# EAGLE design patch (EAGLE 7.2.0)

## Sheet 1 of 3
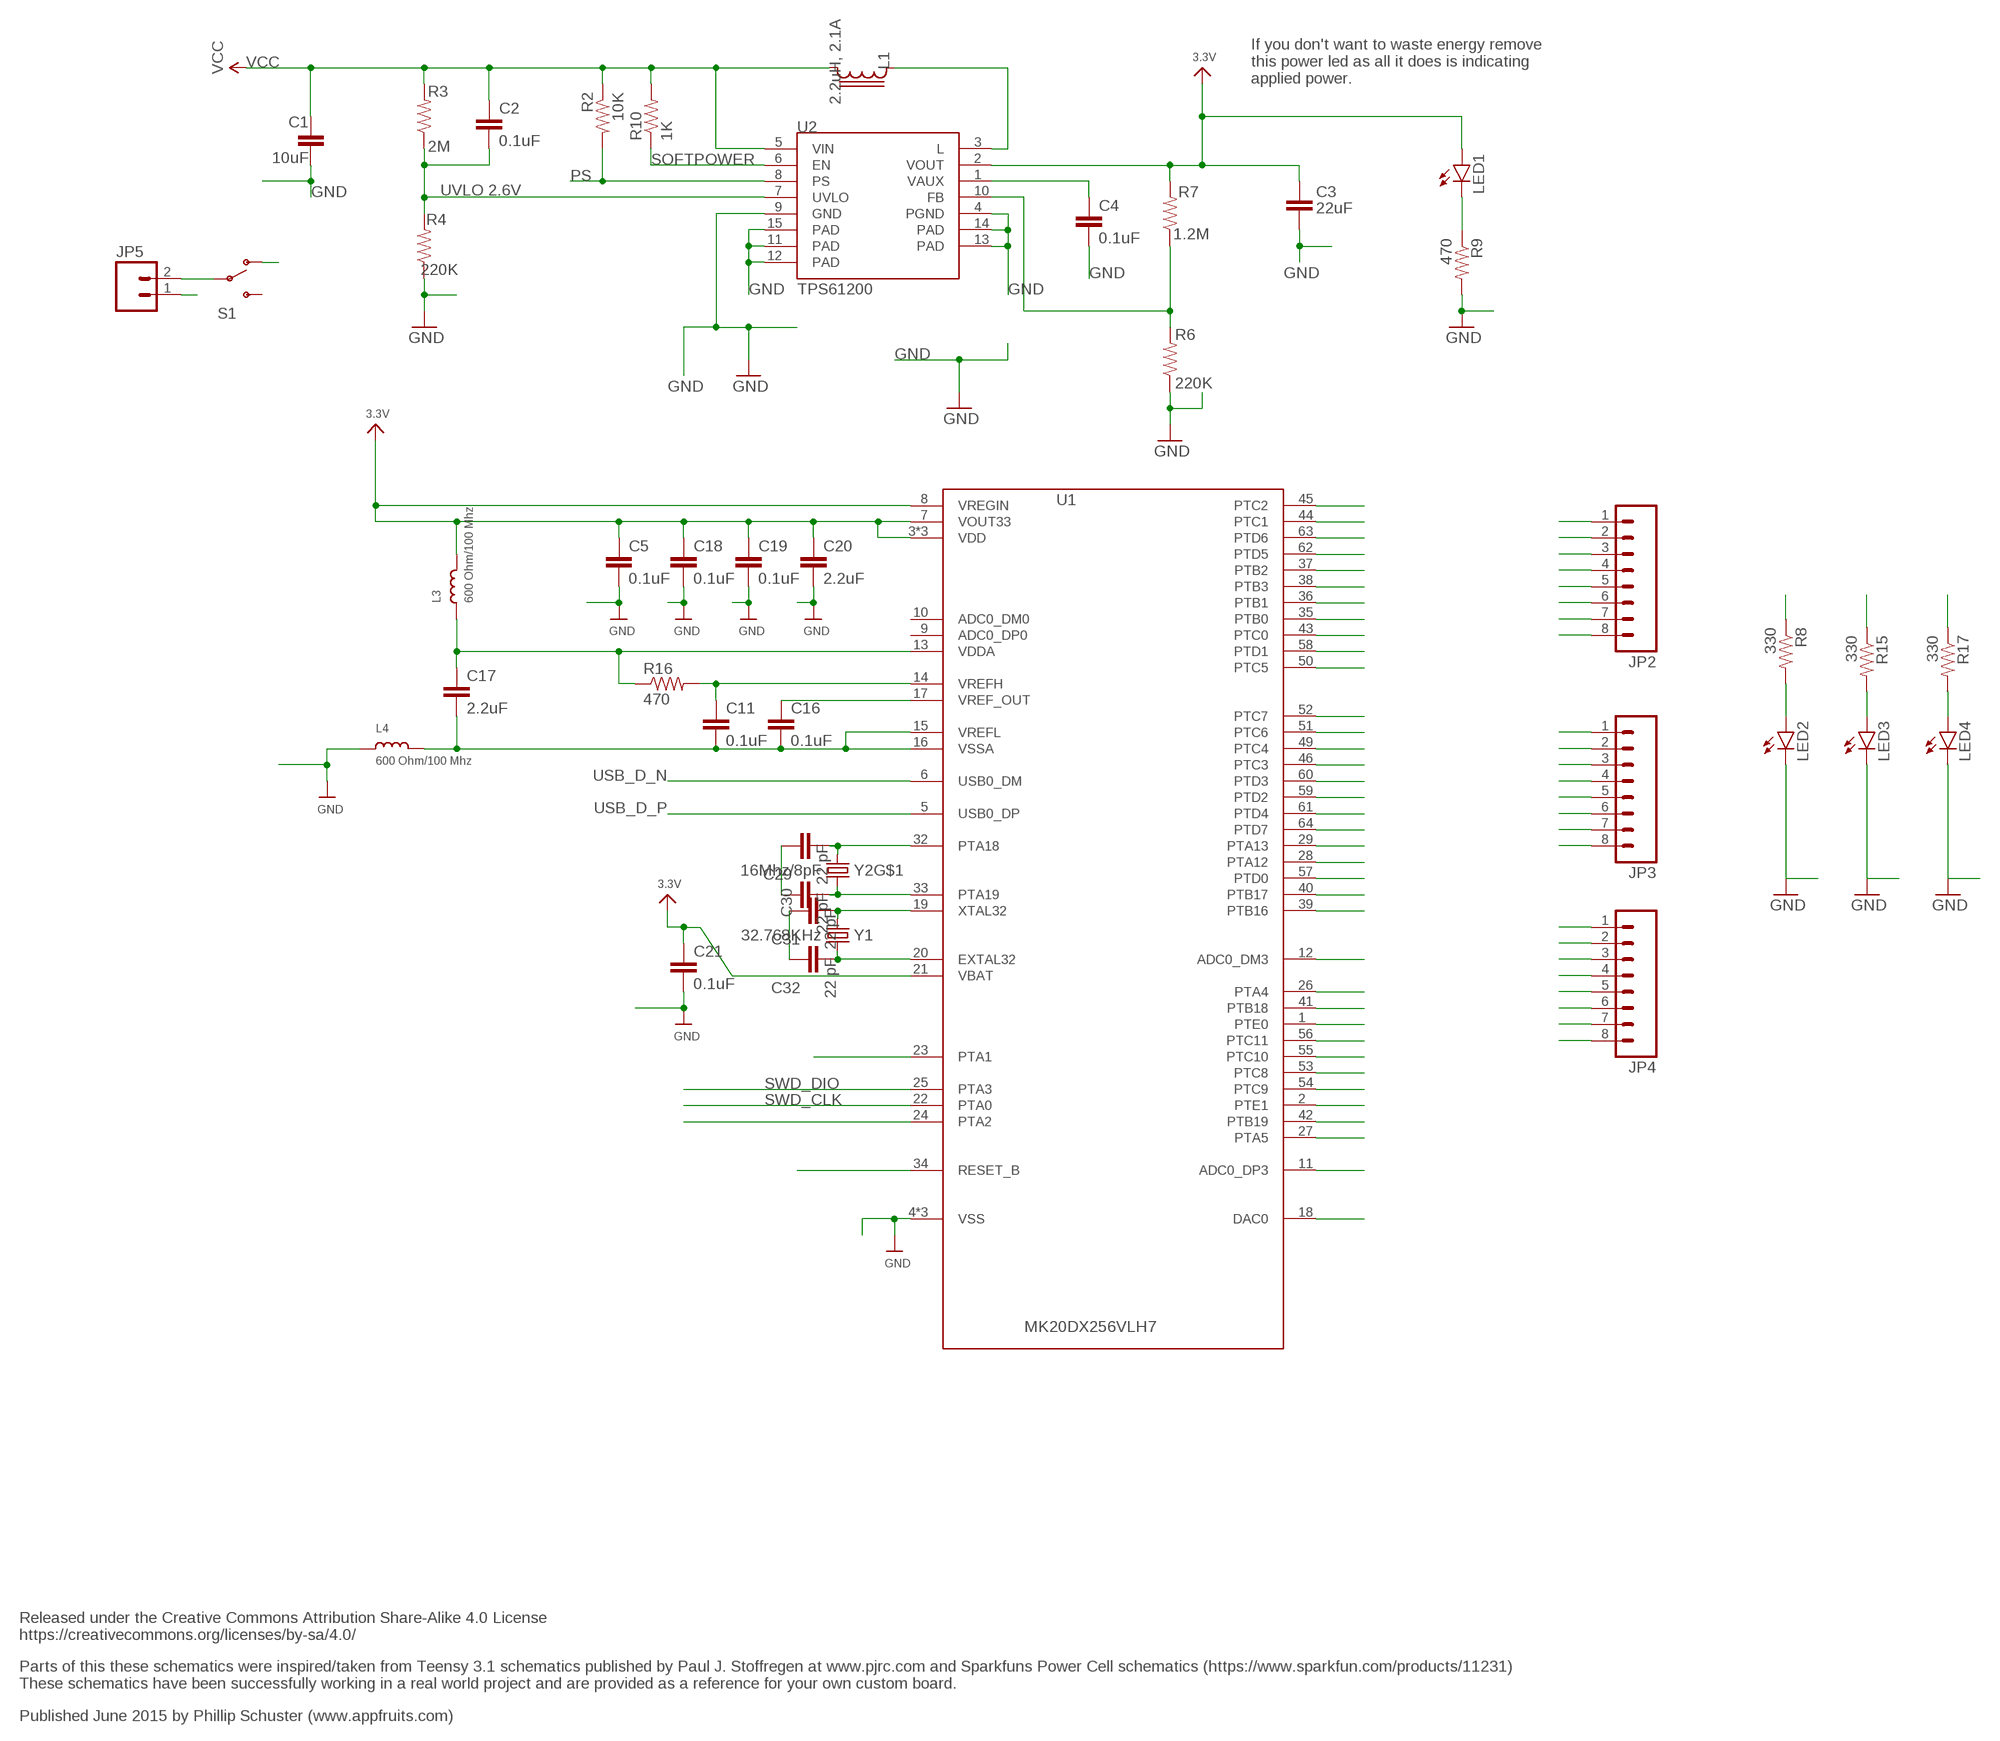
[diagram p0: schematic, sheet 1]

### Parts
C1  10uF  CAPACITOR-10UF  [0603-CAP]
C2  0.1uF  CAPACITOR-0.1UF  [0603-CAP]
C3  22uF  CAPACITOR-22UF  [0603-CAP]
C4  0.1uF  CAPACITOR-0.1UF  [0603-CAP]
C5  0.1uF  CAPACITOR-0.1UF  [0603-CAP]
C11  0.1uF  CAPACITOR-0.1UF  [0603-CAP]
C16  0.1uF  CAPACITOR-0.1UF  [0603-CAP]
C17  2.2uF  CAPACITOR-2.2UF  [0603-CAP]
C18  0.1uF  CAPACITOR-0.1UF  [0603-CAP]
C19  0.1uF  CAPACITOR-0.1UF  [0603-CAP]
C20  2.2uF  CAPACITOR-2.2UF  [0603-CAP]
C21  0.1uF  CAPACITOR-0.1UF  [0603-CAP]
C29  22 pF  CAPACITOR-10UF  [0603-CAP]
C30  22 pF  CAPACITOR-10UF  [0603-CAP]
C31  22 pF  CAPACITOR-10UF  [0603-CAP]
C32  22 pF  CAPACITOR-10UF  [0603-CAP]
JP2  M08SILK_FEMALE_PTH  [1X08]
JP3  M08SILK_FEMALE_PTH  [1X08]
JP4  M08SILK_FEMALE_PTH  [1X08]
JP5  M02PTH  [1X02]
L1  2.2uH, 2.1A  LPS30152.2UH  [LPS3015]
L3  600 Ohm/100 Mhz  INDUCTOR-BK2125HM601-T  [0805]
L4  600 Ohm/100 Mhz  INDUCTOR-BK2125HM601-T  [0805]
LED1  LED-GREEN  [LED-0603]
LED2  LED-GREEN  [LED-0603]
LED3  LED-GREEN  [LED-0603]
LED4  LED-GREEN  [LED-0603]
R2  10K  RESISTOR-10K  [0603-RES]
R3  2M  RESISTOR-2M  [0603-RES]
R4  220K  RESISTOR-220K  [0603-RES]
R6  220K  RESISTOR-220K  [0603-RES]
R7  1.2M  RESISTOR-1.2M  [0603-RES]
R8  330  RESISTOR-470  [0603-RES]
R9  470  RESISTOR-470  [0603-RES]
R10  1K  RESISTOR-1K  [0603-RES]
R15  330  RESISTOR-470  [0603-RES]
R16  470  RESISTOR-470  [0603-RES]
R17  330  RESISTOR-470  [0603-RES]
S1  SWITCH-SPDT-SMD-A  [SWITCH-SPST-SMD-A]
U1  MK20DX256VLH7  [MK20DX256VLH7]
U2  TPS61200  [QFN-10_PAD]
Y1  32.768KHz  CRYSTAL/32.768KHZ/SMD-TXC_7A  [CRYSTAL-TXC-7A]
Y2  16Mhz/8pF  CRYSTAL/SMD-5X3-GND16MHZ/8PF  [CRYSTAL-SMD-5X3]

### Nets
3.3V: C3.1 C5.1 C18.1 C19.1 C20.1 C21.1 JP4.1 JP4.2 JP4.3 JP4.4 JP4.5 JP4.6 JP4.7 JP4.8 L3.2 LED1.A R7.2 U1.3(VDD) U1.7(VOUT33) U1.8(VREGIN) U1.21(VBAT) U1.30(VDD) U1.48(VDD) U2.2(VOUT) ; also sheet 2,3
A12: U1.11(ADC0_DP3)
A13: U1.12(ADC0_DM3)
DAC/A14: U1.18(DAC0)
FB: R6.2 R7.1 U2.10(FB)
GND [Top GND Pour]: C1.2 C3.2 C4.2 C5.2 C18.2 C19.2 C20.2 C21.2 C29.1 C30.1 C31.1 C32.1 JP3.1 JP3.2 JP3.3 JP3.4 JP3.5 JP3.6 JP3.7 JP3.8 JP5.1 L4.1 LED2.C LED3.C LED4.C R4.1 R6.1 R9.2 U1.4(VSS) U1.31(VSS) U1.47(VSS) U2.4(PGND) U2.9(GND) U2.11(PAD) U2.12(PAD) U2.13(PAD) U2.14(PAD) U2.15(PAD) ; also sheet 2,3
ID: U1.23(PTA1) ; also sheet 3
N$1: LED1.C R9.1
N$2: L1.1 U2.3(L)
N$7: LED2.A R8.2
N$8: LED3.A R15.2
N$9: LED4.A R17.2
N$27: C29.2 U1.32(PTA18) Y2.3
N$28: C30.2 U1.33(PTA19) Y2.1
N$29: C31.2 U1.19(XTAL32) Y1.P$2
N$30: C32.2 U1.20(EXTAL32) Y1.P$1
PS: R2.2 U2.8(PS)
PTA2: U1.24(PTA2) ; also sheet 3
PTA4: U1.26(PTA4)
PTA5: U1.27(PTA5)
PTA12: U1.28(PTA12)
PTA13: U1.29(PTA13)
PTB0: U1.35(PTB0) ; also sheet 2
PTB1: U1.36(PTB1) ; also sheet 2
PTB2: R8.1 U1.37(PTB2)
PTB3: U1.38(PTB3)
PTB16: U1.39(PTB16) ; also sheet 2
PTB17: U1.40(PTB17) ; also sheet 2
PTB18: U1.41(PTB18) ; also sheet 2
PTB19: U1.42(PTB19) ; also sheet 2
PTC0: U1.43(PTC0) ; also sheet 2
PTC1: U1.44(PTC1) ; also sheet 2
PTC2: R15.1 U1.45(PTC2)
PTC3: R17.1 U1.46(PTC3)
PTC4: U1.49(PTC4) ; also sheet 2
PTC5: U1.50(PTC5) ; also sheet 2
PTC6: U1.51(PTC6) ; also sheet 2
PTC7: U1.52(PTC7) ; also sheet 2
PTC8: U1.53(PTC8) ; also sheet 2
PTC9: U1.54(PTC9) ; also sheet 2
PTC10: JP2.8 U1.55(PTC10)
PTC11: JP2.7 U1.56(PTC11)
PTD0: JP2.6 U1.57(PTD0)
PTD1: JP2.5 U1.58(PTD1)
PTD2: JP2.4 U1.59(PTD2)
PTD3: JP2.3 U1.60(PTD3)
PTD4: JP2.2 U1.61(PTD4)
PTD5: JP2.1 U1.62(PTD5)
PTD6: U1.63(PTD6)
PTD7: U1.64(PTD7)
PTE0: U1.1(PTE0)
PTE1: U1.2(PTE1)
RESET_B: U1.34(RESET_B) ; also sheet 3
SOFTPOWER: R10.1 U2.6(EN)
SWD_CLK: U1.22(PTA0) ; also sheet 3
SWD_DIO: U1.25(PTA3) ; also sheet 3
USB_D_N [USB]: U1.6(USB0_DM) ; also sheet 3
USB_D_P [USB]: U1.5(USB0_DP) ; also sheet 3
UVLO: C2.2 R3.1 R4.2 U2.7(UVLO)
VAUX: C4.1 U2.1(VAUX)
VCC: C1.1 C2.1 L1.2 R2.1 R3.2 R10.2 S1.1(O) U2.5(VIN) ; also sheet 3
VDDA: C17.1 L3.1 R16.1 U1.13(VDDA)
VRAW [Top GND Pour]: JP5.2 S1.2(P)
VREF_OUT: C16.1 U1.17(VREF_OUT)
VREFH: C11.1 R16.2 U1.14(VREFH)
VREFL: C11.2 C16.2 C17.2 L4.2 U1.15(VREFL) U1.16(VSSA)
Unconnected: S1.3(S) U1.9(ADC0_DP0) U1.10(ADC0_DM0) Y2.2(GND:GND) Y2.4(GND:GND)

### Notes on the sheet
- If you don't want to waste energy remove
  this power led as all it does is indicating
  applied power.
- UVLO 2.6V
- Released under the Creative Commons Attribution Share-Alike 4.0 License
  https://creativecommons.org/licenses/by-sa/4.0/
- Parts of this these schematics were inspired/taken from Teensy 3.1 schematics published by Paul J. Stoffregen at www.pjrc.com and Sparkfuns Power Cell schematics (https://www.sparkfun.com/products/11231)
  These schematics have been successfully working in a real world project and are provided as a reference for your own custom board.
- Published June 2015 by Phillip Schuster (www.appfruits.com)

## Sheet 2 of 3
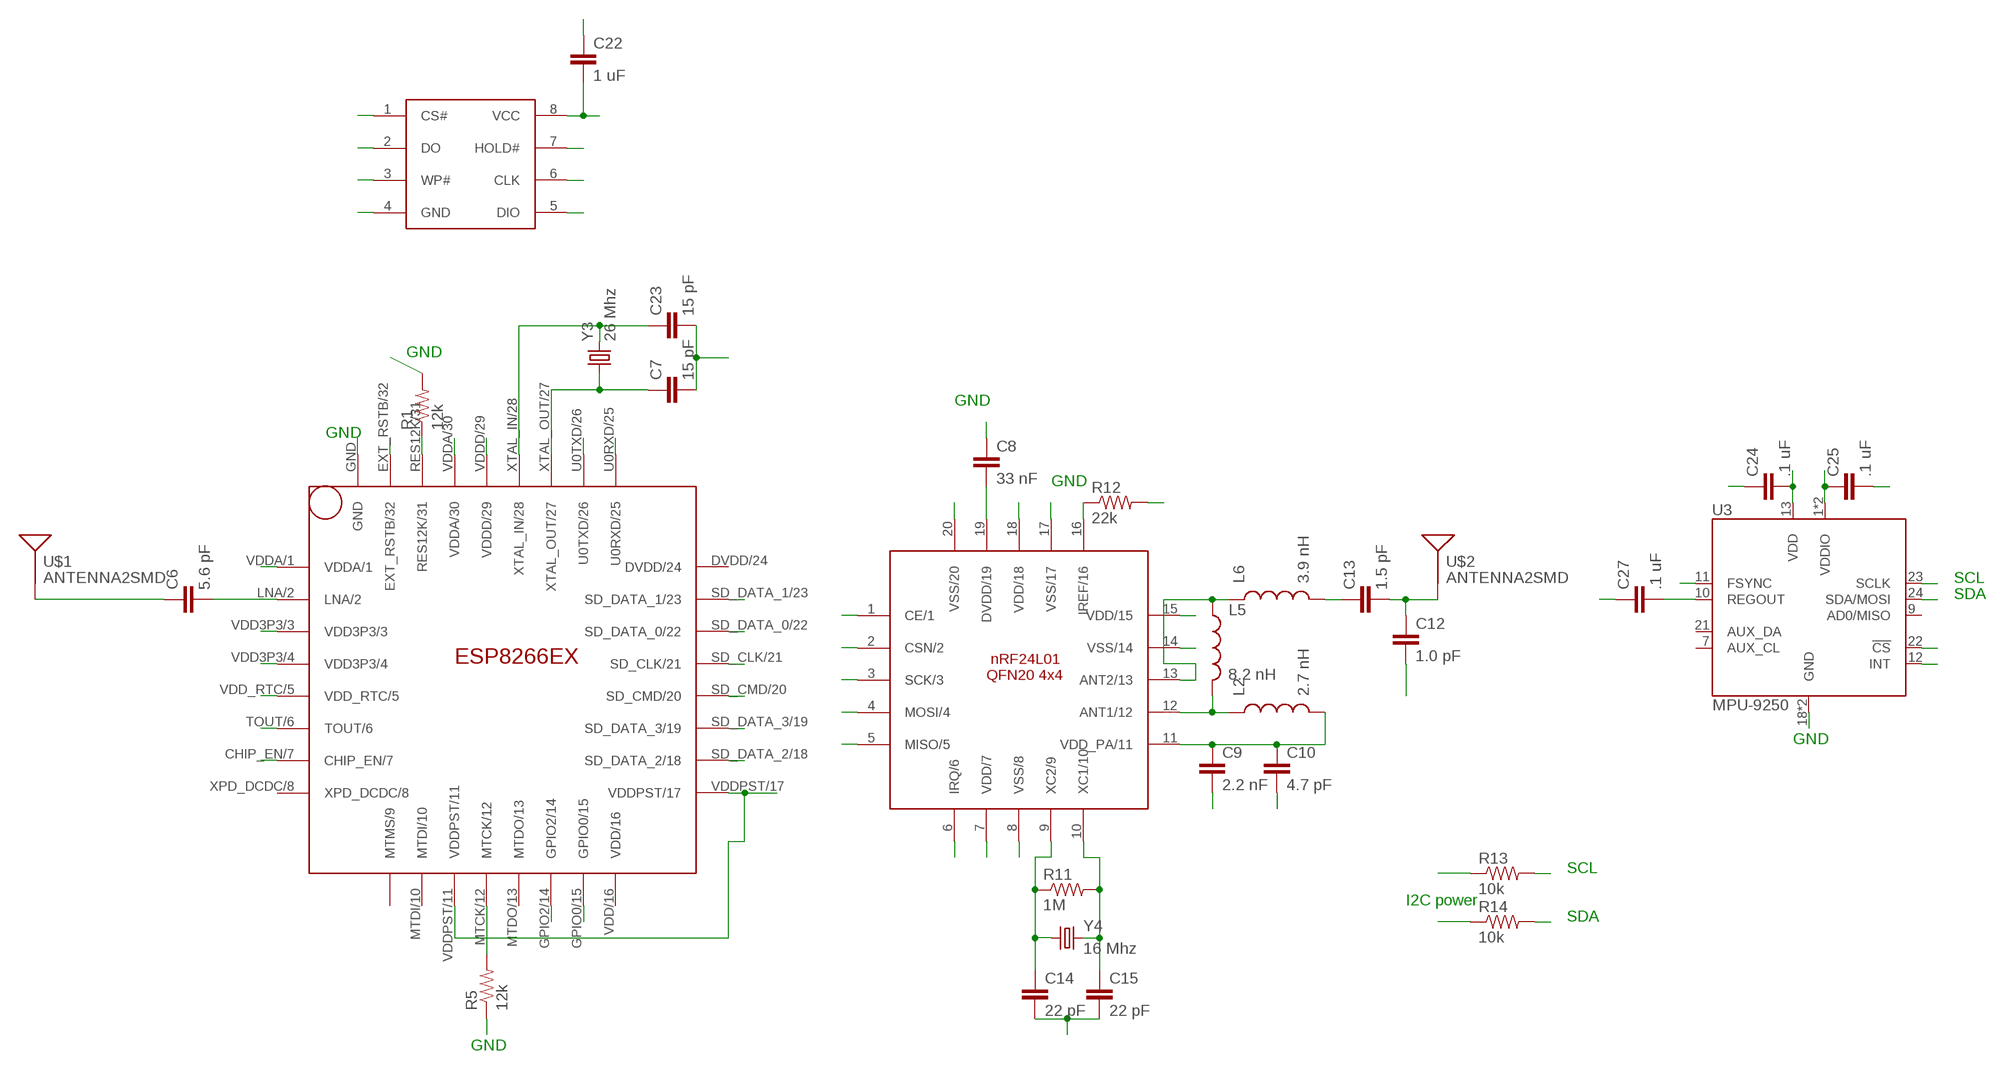
[diagram p1: schematic, sheet 2]

### Parts
C6  5.6 pF  CAP0603-CAP  [0603-CAP]
C7  15 pF  CAP0603-CAP  [0603-CAP]
C8  33 nF  CAP0603-CAP  [0603-CAP]
C9  2.2 nF  CAP0603-CAP  [0603-CAP]
C10  4.7 pF  CAP0603-CAP  [0603-CAP]
C12  1.0 pF  CAP0603-CAP  [0603-CAP]
C13  1.5 pF  CAP0603-CAP  [0603-CAP]
C14  22 pF  CAP0603-CAP  [0603-CAP]
C15  22 pF  CAP0603-CAP  [0603-CAP]
C22  1 uF  CAP0603-CAP  [0603-CAP]
C23  15 pF  CAP0603-CAP  [0603-CAP]
C24  .1 uF  CAP0603-CAP  [0603-CAP]
C25  .1 uF  CAP0603-CAP  [0603-CAP]
C27  .1 uF  CAP0603-CAP  [0603-CAP]
L2  2.7 nH  INDUCTOR0402  [C0402]
L5  8.2 nH  INDUCTOR0402  [C0402]
L6  3.9 nH  INDUCTOR0402  [C0402]
R1  12k  RESISTOR0603-RES  [0603-RES]
R5  12k  RESISTOR0603-RES  [0603-RES]
R11  1M  RESISTOR0603-RES  [0603-RES]
R12  22k  RESISTOR0603-RES  [0603-RES]
R13  10k  RESISTOR0603-RES  [0603-RES]
R14  10k  RESISTOR0603-RES  [0603-RES]
U3  MPU-9250  [QFN-24/3MM]
U$1  ANTENNA2SMD  [ANTENNA-CHIP2]
U$2  ANTENNA2SMD  [ANTENNA-CHIP2]
U$3  25Q40  [SOP8]
U$4  NRF24L01  [QFN20(4X4)]
U$6  ESP8266EX  [QFN32]
Y3  26 Mhz  CRYSTAL5X3  [CRYSTAL-SMD-5X3]
Y4  16 Mhz  CRYSTAL5X3  [CRYSTAL-SMD-5X3]

### Nets
3.3V: C22.2 C24.2 C25.1 R13.1 R14.1 U3.1(VDDIO) U3.8(VDDIO) U3.13(VDD) U3.22(!CS) U$3.8(VCC) U$4.7(VDD/7) U$4.18(VDD/18) U$6.VDD3P3/3 U$6.VDD3P3/4 U$6.VDDA/1 U$6.VDDD/29 U$6.VDDPST/11 U$6.VDDPST/17 ; also sheet 1,3
GND [Top GND Pour]: C7.2 C8.1 C9.2 C10.2 C12.2 C14.2 C15.2 C22.1 C23.2 C24.1 C25.2 C27.1 R1.2 R5.1 R12.2 U3.18(GND) U3.20(GND) U$3.4(GND) U$4.8(VSS/8) U$4.17(VSS/17) U$4.20(VSS/20) U$6.GND ; also sheet 1,3
N$13: C6.2 U$6.LNA/2
N$16: C6.1 U$1.FEED(SIGNAL)
N$17: C14.1 R11.1 U$4.9(XC2/9) Y4.1
N$18: C15.1 R11.2 U$4.10(XC1/10) Y4.3
N$19: C9.1 C10.1 L2.2 U$4.11(VDD_PA/11)
N$20: L5.1 L6.1 U$4.13(ANT2/13)
N$21: C8.2 U$4.19(DVDD/19)
N$23: L2.1 L5.2 U$4.12(ANT1/12)
N$24: R12.1 U$4.16(IREF/16)
N$25: C13.1 L6.2
N$26: C12.1 C13.2 U$2.FEED(SIGNAL)
N$32: R5.2 U$6.MTCK/12
N$34: C27.2 U3.10(REGOUT)
N$38: R1.1 U$6.RES12K/31
PTB0: U3.12(INT) ; also sheet 1
PTB1: U3.11(FSYNC) ; also sheet 1
PTB16: U$6.U0RXD/25 ; also sheet 1
PTB17: U$6.U0TXD/26 ; also sheet 1
PTB18: U$6.GPIO0/15 ; also sheet 1
PTB19: U$6.GPIO2/14 ; also sheet 1
PTC0: U$6.EXT_RSTB/32 ; also sheet 1
PTC1: U$6.CHIP_EN/7 ; also sheet 1
PTC4: U$4.2(CSN/2) ; also sheet 1
PTC5: U$4.3(SCK/3) ; also sheet 1
PTC6: U$4.4(MOSI/4) ; also sheet 1
PTC7: U$4.5(MISO/5) ; also sheet 1
PTC8: U$4.6(IRQ/6) ; also sheet 1
PTC9: U$4.1(CE/1) ; also sheet 1
RTC: U$6.VDD_RTC/5
SCL: R14.2 U3.23(SCLK)
SD-CLK: U$3.6(CLK) U$6.SD_CLK/21
SD-CMD: U$3.1(CS#) U$6.SD_CMD/20
SD-D0: U$3.2(DO) U$6.SD_DATA_0/22
SD-D1: U$3.5(DIO) U$6.SD_DATA_1/23
SD-D2: U$3.7(HOLD#) U$6.SD_DATA_2/18
SD-D3: U$3.3(WP#) U$6.SD_DATA_3/19
SDA: R13.2 U3.24(SDA/MOSI)
TOUT: U$6.TOUT/6
VDD: U$6.VDDA/30
XTAL_IN: C23.1 U$6.XTAL_IN/28 Y3.3
XTAL_OUT: C7.1 U$6.XTAL_OUT/27 Y3.1
Unconnected: U3.7(AUX_CL) U3.9(AD0/MISO) U3.21(AUX_DA) U$4.14(VSS/14) U$4.15(VDD/15) U$6.DVDD/24 U$6.MTDI/10 U$6.MTDO/13 U$6.MTMS/9 U$6.VDD/16 U$6.XPD_DCDC/8

### Notes on the sheet
- GND
- GND
- GND
- GND
- SCL
- SDA
- GND
- SCL
- I2C power
- SDA
- GND

## Sheet 3 of 3
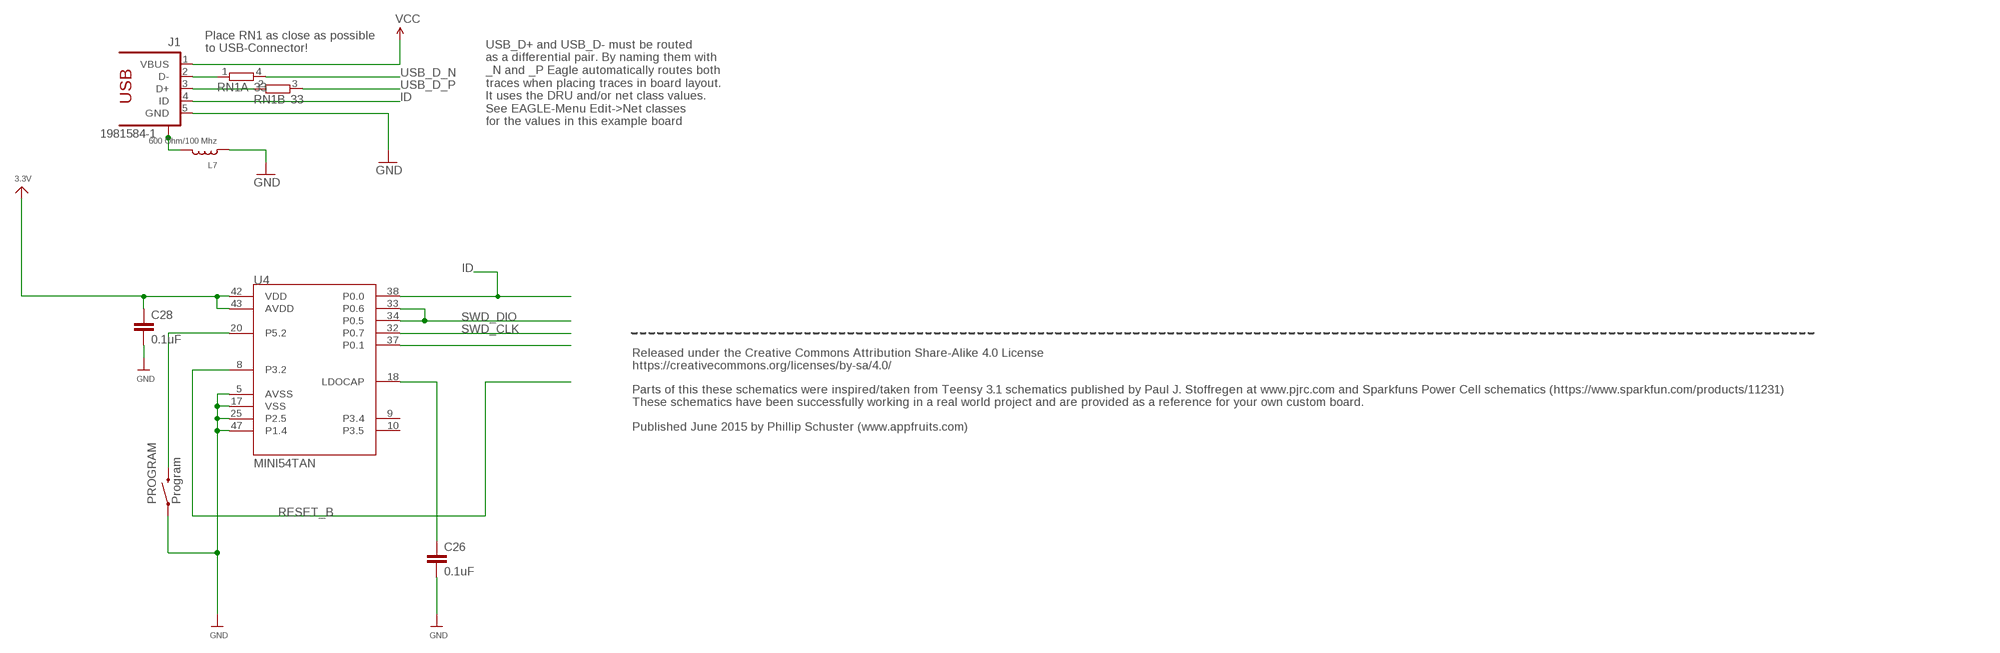
[diagram p2: schematic, sheet 3]

### Parts
C26  0.1uF  CAPACITOR-0.1UF  [0603-CAP]
C28  0.1uF  CAPACITOR-0.1UF  [0603-CAP]
J1  1981584-1  [1981584-1]
L7  600 Ohm/100 Mhz  INDUCTOR-BK2125HM601-T  [0805]
PROGRAM  Program  SWITCH-MOMENTARY-2-SMD-1101NE  [TACTILE-SWITCH-1101NE]
RN1  33  2R-NEXB34V  [EXB34V]
U4  MINI54TAN  [MINI54TAN]

### Nets
3.3V: C28.1 U4.42(VDD) U4.43(AVDD) ; also sheet 1,2
GND [Top GND Pour]: C26.2 C28.2 J1.5(GND) L7.1 PROGRAM.P$1 U4.5(AVSS) U4.17(VSS) U4.25(P2.5) U4.47(P1.4) ; also sheet 1,2
ID: J1.4(ID) U4.38(P0.0) ; also sheet 1
N$10: PROGRAM.P$2 U4.20(P5.2)
N$11: C26.1 U4.18(LDOCAP)
PTA2: U4.37(P0.1) ; also sheet 1
RESET_B: U4.8(P3.2) ; also sheet 1
SWD_CLK: U4.32(P0.7) ; also sheet 1
SWD_DIO: U4.33(P0.6) U4.34(P0.5) ; also sheet 1
USB_CON_N [USB]: J1.2(D-) RN1.1
USB_CON_P [USB]: J1.3(D+) RN1.2
USB_D_N [USB]: RN1.4 ; also sheet 1
USB_D_P [USB]: RN1.3 ; also sheet 1
USB_SHIELD: J1.S1 J1.S2 J1.S3 J1.S4 L7.2
VCC: J1.1(VBUS) ; also sheet 1
Unconnected: U4.9(P3.4) U4.10(P3.5)

### Notes on the sheet
- Place RN1 as close as possible
  to USB-Connector!
- USB_D+ and USB_D- must be routed
  as a differential pair. By naming them with
  _N and _P Eagle automatically routes both
  traces when placing traces in board layout.
  It uses the DRU and/or net class values. 
  See EAGLE-Menu Edit->Net classes 
  for the values in this example board
- Released under the Creative Commons Attribution Share-Alike 4.0 License
  https://creativecommons.org/licenses/by-sa/4.0/
- Parts of this these schematics were inspired/taken from Teensy 3.1 schematics published by Paul J. Stoffregen at www.pjrc.com and Sparkfuns Power Cell schematics (https://www.sparkfun.com/products/11231)
  These schematics have been successfully working in a real world project and are provided as a reference for your own custom board.
- Published June 2015 by Phillip Schuster (www.appfruits.com)

## Library data of the parts
C1 = appfruits:CAPACITOR; MF: Murata; MPN: GRM188R60J106ME47D
C2 C4 C5 C11 C16 C18 C19 C21 C26 C28 = appfruits:CAPACITOR; MF: Kemet; MPN: C0603C104J3RACTU
C3 = appfruits:CAPACITOR; MF: Murata; MPN: GRM188R60J226MEA0D
C6-C10 C12-C15 C22-C25 C27 = SparkFun-Capacitors:CAP: Capacitor Standard 0603 ceramic capacitor, and 0.1" leaded capacitor.
C17 C20 = appfruits:CAPACITOR; MF: Kemet; MPN: C0603C225K4PACTU
C29-C32 = appfruits:CAPACITOR; MF: Murata; MPN: GRM188R60J106ME47D; VALUE: 10uF
J1 = con-usb:1981584-1: Receptacle, micro-USB, type A/B Tyco Electronics; MF: Hirose; MPN: ZX62-AB-5PA(11)
JP2-JP4 = SparkFun-Connectors:M08: Header 8 Standard 8-pin 0.1" header. Use with straight break away headers (SKU : PRT-00116), right angle break away headers (PRT-00553), swiss pins (PRT-00743), machine pins (PRT-00117), and female headers (PRT-00115).; PROD_ID: CONN-08438
JP5 = SparkFun-Connectors:M02: Standard 2-pin 0.1" header. Use with - straight break away headers ( PRT-00116) - right angle break away headers (PRT-00553) - swiss pins (PRT-00743) - machine pins (PRT-00117) - female headers (PRT-00115) Molex polarized connector foot print use with: PRT-08233 with associated crimp pins and housings. 2.54_SCREWTERM for use with PRT-10571. 3.5mm Screw Terminal footprints for PRT-08084 5mm Screw Terminal footprints for use with PRT-08432
L1 = appfruits:LPS3015: Shielded Power Inductor; MF: Coilcraft; MPN: LPS3015-222MRB
L2 L5 L6 = SparkFun-Passives:INDUCTOR: Inductors
L3 L4 L7 = appfruits:INDUCTOR: Inductors; MF: Taiyo Yuden; MPN: BK2125HM601-T
LED1-LED4 = appfruits:LED: LEDs Standard schematic elements and footprints for 5mm, 3mm, 1206, and 0603 sized LEDs. 5mm - Spark Fun Electronics SKU : COM-00529 (and others); MF: Avago; MPN: HSMG-C190
PROGRAM = SparkFun-Electromechanical:SWITCH-MOMENTARY-2: Various NO switches- pushbuttons, reed, etc; MF: C&K Components; MPN: RS-282G05A3-SM RT
R1 R5 R11-R14 = SparkFun-Resistors:RESISTOR: Resistor Basic schematic elements and footprints for 0603, 1206, and PTH resistors.
R2 = appfruits:RESISTOR: Resistor Basic schematic elements and footprints for 0603, 1206, and PTH resistors.; MF: Panasonic; MPN: ERJ-3GEYJ103V
R3 = appfruits:RESISTOR: Resistor Basic schematic elements and footprints for 0603, 1206, and PTH resistors.; MF: Panasonic; MPN: ERJ-3GEYJ205V
R4 R6 = appfruits:RESISTOR: Resistor Basic schematic elements and footprints for 0603, 1206, and PTH resistors.; MF: Panasonic; MPN: ERJ-3GEYJ224V
R7 = appfruits:RESISTOR: Resistor Basic schematic elements and footprints for 0603, 1206, and PTH resistors.; MF: Panasonic; MPN: ERJ-3GEYJ125V
R8 R15 R17 = appfruits:RESISTOR: Resistor Basic schematic elements and footprints for 0603, 1206, and PTH resistors.; MF: Panasonic; MPN: ERJ-3GEYJ471V; VALUE: 470
R9 R16 = appfruits:RESISTOR: Resistor Basic schematic elements and footprints for 0603, 1206, and PTH resistors.; MF: Panasonic; MPN: ERJ-3GEYJ471V
R10 = appfruits:RESISTOR: Resistor Basic schematic elements and footprints for 0603, 1206, and PTH resistors.; MF: Panasonic; MPN: ERJ-3GEYJ102V
RN1 = resistor-dil:2R-N: Array Chip Resistor Source: Panasonic; MF: Panasonic; MPN: EXB-34V330JV; OC_FARNELL: unknown; OC_NEWARK: unknown
S1 = SparkFun-Electromechanical:SWITCH-SPDT: SPDT Switch Simple slide switch, Spark Fun Electronics SKU : COM-00102 DPDT SMT slide switch, AYZ0202, SWCH-08179
U1 = appfruits:MK20DX256VLH7; MF: Freescale; MPN: MK20DX256VLH7
U2 = appfruits:TPS61200: DC to DC Booster IC-10035; MF: Texas Instruments; MPN: TPS61200DRCR; PROD_ID: IC-10035
U3 = chips:MPU-9250: GYRO/ACCEL/COMPASS/9-AXIS; DIGIKEY: 1428-1019-1-ND
U4 = TeensyCustom:MINI54TAN: MINI54TAN Bootloader from PJRC.com, preprogrammed with Teensy 3.0 bootloader. https://www.pjrc.com/store/ic_mini54_tqfp.html
U$1 U$2 = SparkFun-RF:ANTENNA2: Chip antenna Single endded antenna. Common with smaller chip antennas. CHIP4 package is the GPS Chip Antenna SKU: GPS-08418. CHIP5 package is 2.4GHz chip antenna SKU: WRL-00144.
U$3 = wifi:25Q40
U$4 = RF:NRF24L01
U$6 = wifi:ESP8266EX
Y1 = appfruits:CRYSTAL/32.768KHZ/SMD-TXC_7A; MF: Epson Timing; MPN: FC-255 32.7680K-A3
Y2 = appfruits:CRYSTAL/SMD-5X3-GND; MF: ECS; MPN: ECS-160-8-30B-CKM
Y3 Y4 = SparkFun-FreqCtrl:CRYSTAL: Various standard crystals. Proven footprints.; PROD_ID: XTAL-08218

## Net classes
1 USB: width 0.254 mm, drill 0.33 mm, clearance 0.159 mm

## Board
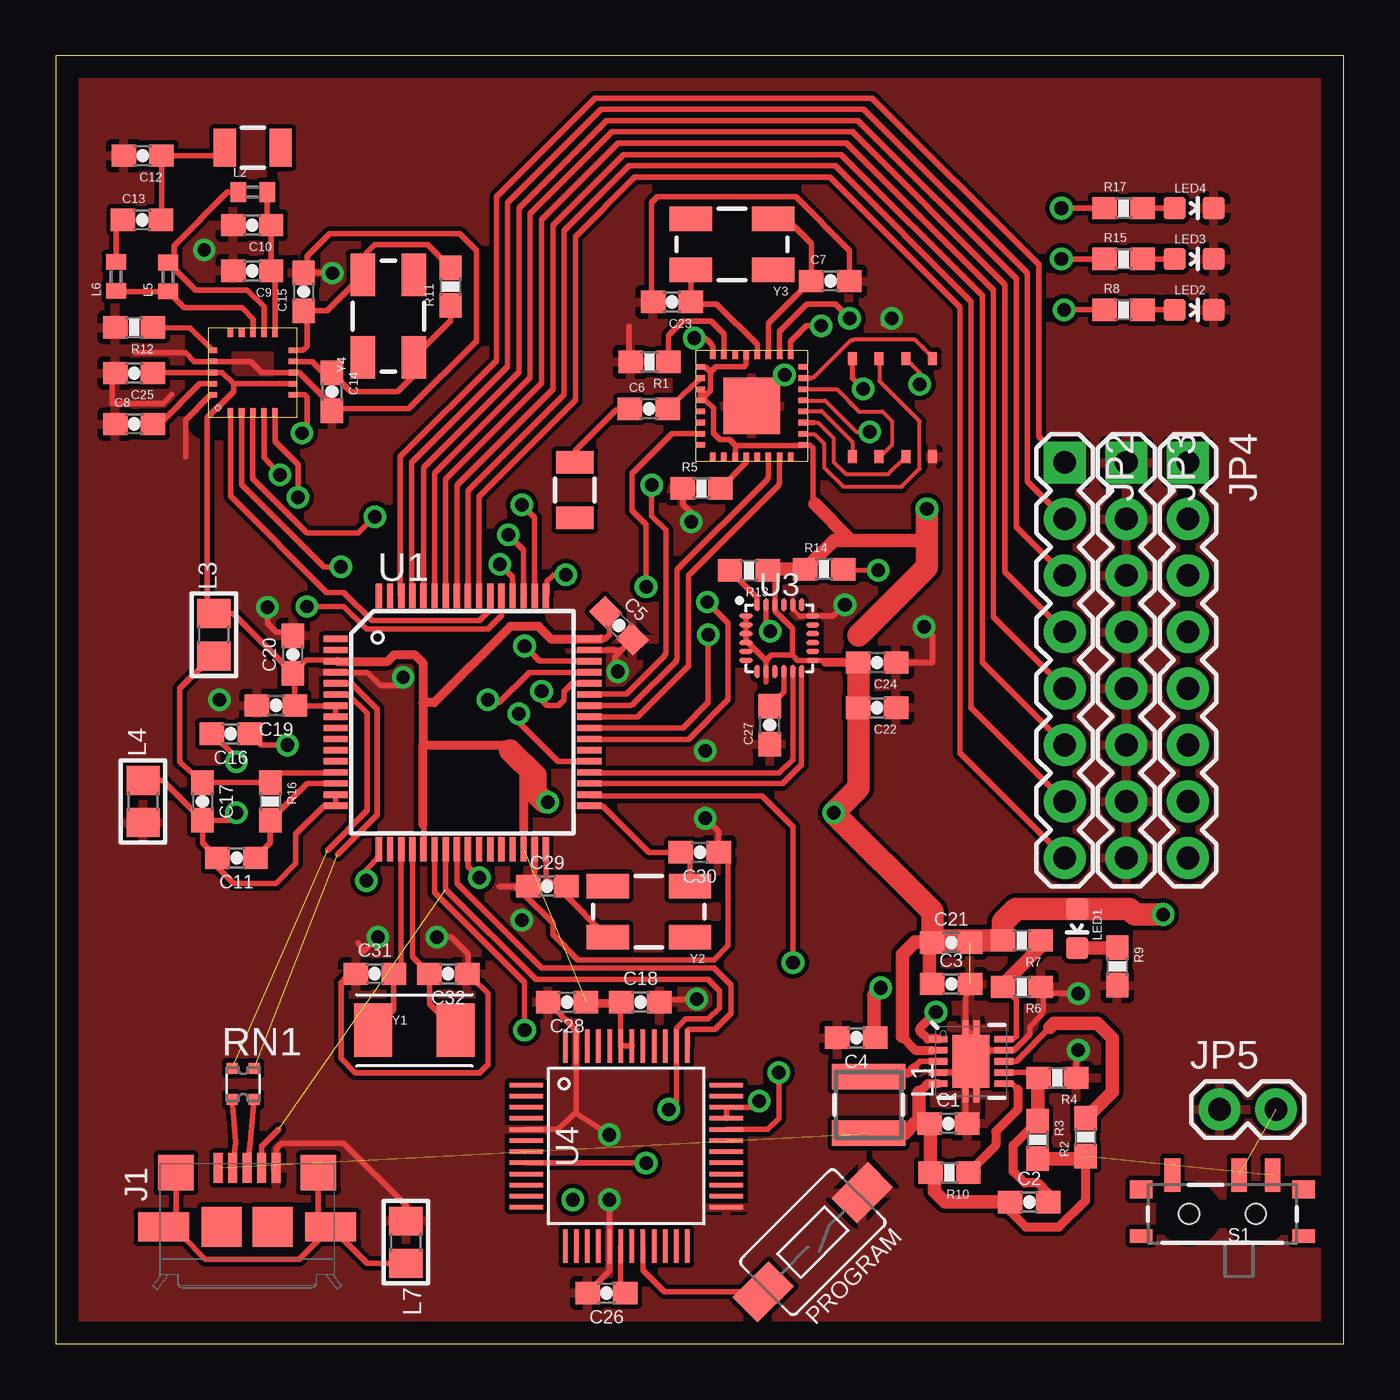
[diagram p3: board, top side]
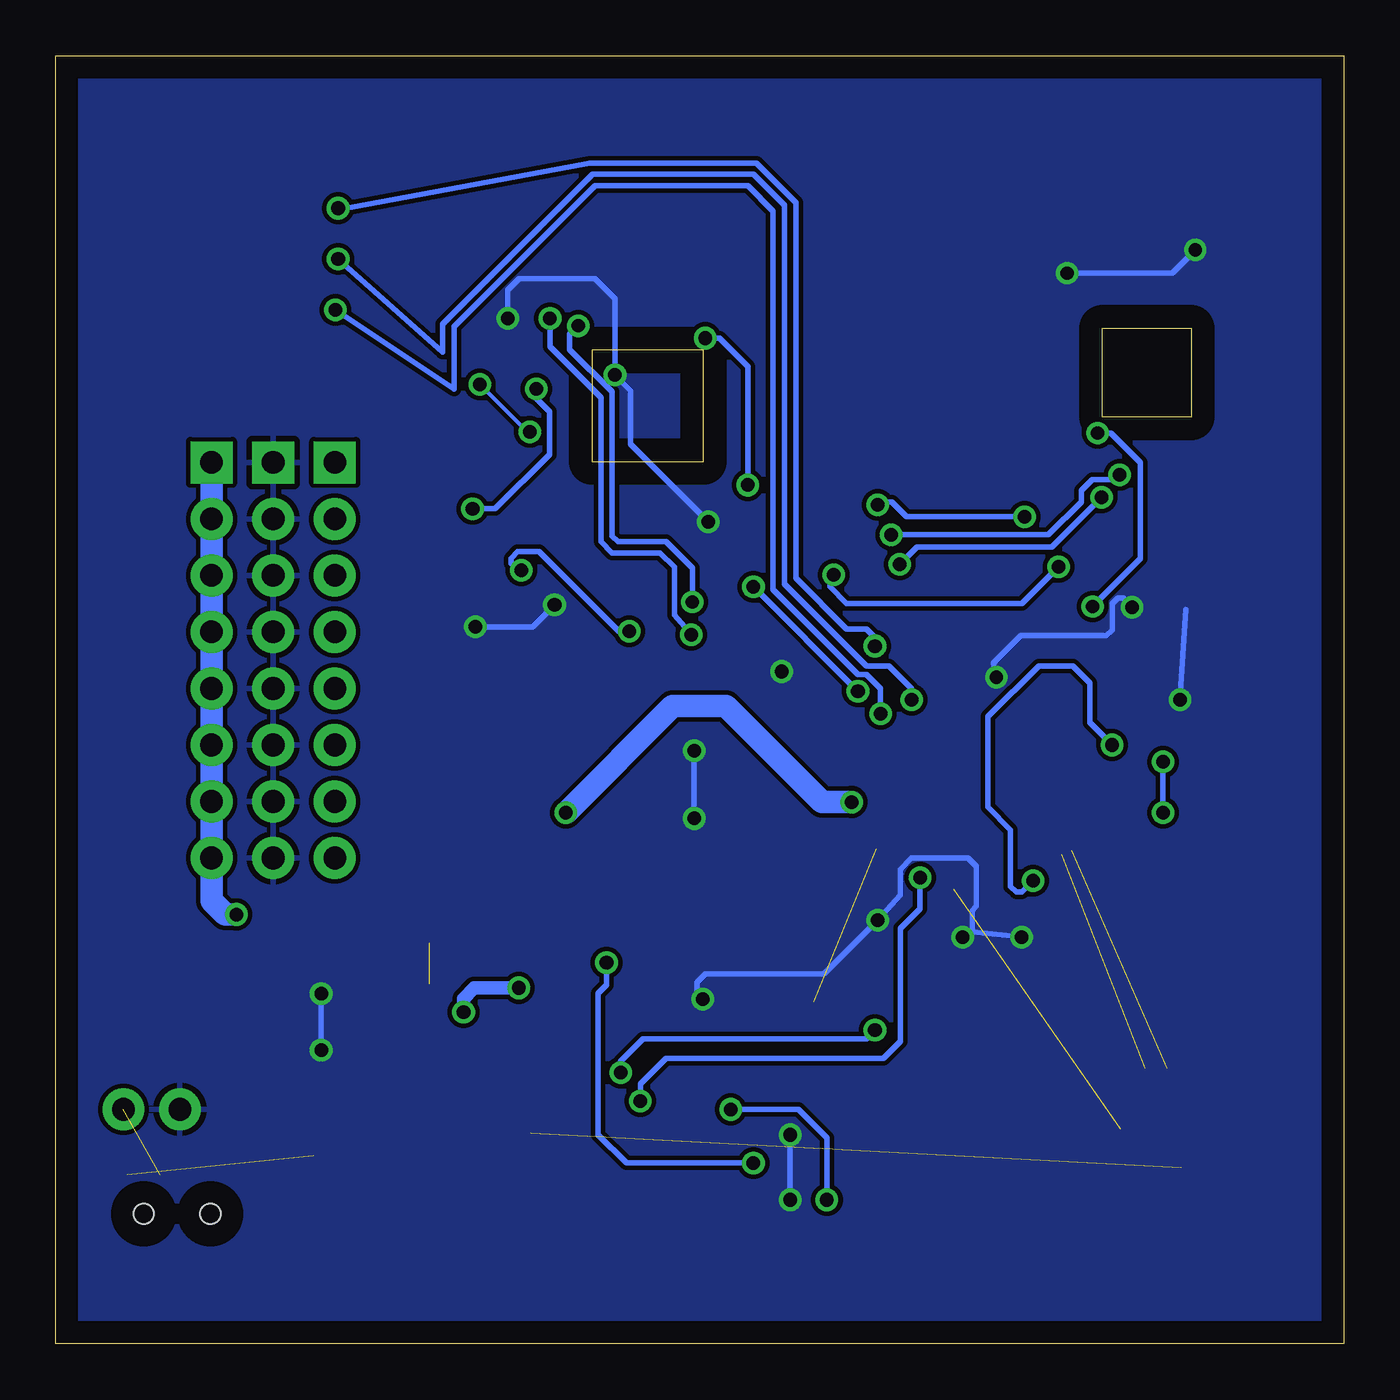
[diagram p4: board, bottom side, seen from below]

Size 57.91 x 57.91 mm. Coordinates in mm from the lower left corner, seen from the top.
Outline: 0,0 57.91,0 57.91,57.91 0,57.91 0,0
Copper layers (1*16): Top 0.035mm / dielectric 1.5mm / Bottom 0.035mm
Design rules "default": minimum track width 10mil, minimum drill 24mil, track to track 8mil, track to pad 8mil, pad to pad 8mil, via to via 8mil, smd to smd 8mil, copper to edge 40mil, drill to drill 8mil, minimum pad ring 10mil, minimum via ring 8mil, stop-mask expansion 4mil, vias tented up to drill 0mil, thermal gap 10mil
tRestrict: area 8.9,5.3 to 11.7,6.2

### Footprints (pad centres in the part's own frame; a part is rotated, then mirrored left to right if it is on the bottom)
0603-CAP = smd 1.1 x 1: 1 -0.85,0; 2 0.85,0
1981584-1 = smd 0.4 x 1.35: 1 -1.3,4.1; 2 -0.65,4.1; 3 0,4.1; 4 0.65,4.1; 5 1.3,4.1 | smd 1.8 x 1.8: M1 -1.15,1.45; M2 1.15,1.45 | smd 2.3 x 1.3: S1 -3.75,1.45; S2 3.75,1.45 | smd 1.6 x 1.6: S3 -3.2,3.885; S4 3.2,3.885
1X08 = drill 1.016 pad 1.88 square: 1 0,0 | drill 1.016 pad 1.88: 2 2.54,0; 3 5.08,0; 4 7.62,0; 5 10.16,0; 6 12.7,0; 7 15.24,0; 8 17.78,0
1X02 = drill 1.016 pad 1.88: 1 0,0; 2 2.54,0
LPS3015 = smd 1.14 x 3.3: 1 -1.27,0; 2 1.27,0
C0402 = smd 0.7 x 0.9: 1 -0.65,0; 2 0.65,0
0805 = smd 1.3 x 1.5: 1 -0.95,0; 2 0.95,0
LED-0603 = smd 1 x 1: A 0,-0.877; C 0,0.877
TACTILE-SWITCH-1101NE = smd 2.3 x 1.6: P$1 -3.15,0; P$2 3.15,0
0603-RES = smd 1.1 x 1: 1 -0.85,0; 2 0.85,0
EXB34V = smd 0.5 x 0.5: 1 -0.5,-0.7; 2 0.5,-0.7; 3 0.5,0.7; 4 -0.5,0.7
SWITCH-SPST-SMD-A = smd 0.7 x 1.5: 1 -2.25,-1.75; 2 -0.75,-1.75; 3 2.25,-1.75 | smd 1 x 0.6: GND1 -3.65,1; GND3 3.65,1 | smd 1 x 0.8: GND2 -3.65,-1.1; GND4 3.65,-1.1 | hole 0.9: -1.5,0; 1.5,0
MK20DX256VLH7 = smd 1.1 x 0.285: 1 -5.7,3.75; 2 -5.7,3.25; 3 -5.7,2.75; 4 -5.7,2.25; 5 -5.7,1.75; 6 -5.7,1.25; 7 -5.7,0.75; 8 -5.7,0.25; 9 -5.7,-0.25; 10 -5.7,-0.75; 11 -5.7,-1.25; 12 -5.7,-1.75; 13 -5.7,-2.25; 14 -5.7,-2.75; 15 -5.7,-3.25; 16 -5.7,-3.75; 33 5.7,-3.75; 34 5.7,-3.25; 35 5.7,-2.75; 36 5.7,-2.25; 37 5.7,-1.75; 38 5.7,-1.25; 39 5.7,-0.75; 40 5.7,-0.25; 41 5.7,0.25; 42 5.7,0.75; 43 5.7,1.25; 44 5.7,1.75; 45 5.7,2.25; 46 5.7,2.75; 47 5.7,3.25; 48 5.7,3.75 | smd 0.285 x 1.1: 17 -3.75,-5.7; 18 -3.25,-5.7; 19 -2.75,-5.7; 20 -2.25,-5.7; 21 -1.75,-5.7; 22 -1.25,-5.7; 23 -0.75,-5.7; 24 -0.25,-5.7; 25 0.25,-5.7; 26 0.75,-5.7; 27 1.25,-5.7; 28 1.75,-5.7; 29 2.25,-5.7; 30 2.75,-5.7; 31 3.25,-5.7; 32 3.75,-5.7; 49 3.75,5.7; 50 3.25,5.7; 51 2.75,5.7; 52 2.25,5.7; 53 1.75,5.7; 54 1.25,5.7; 55 0.75,5.7; 56 0.25,5.7; 57 -0.25,5.7; 58 -0.75,5.7; 59 -1.25,5.7; 60 -1.75,5.7; 61 -2.25,5.7; 62 -2.75,5.7; 63 -3.25,5.7; 64 -3.75,5.7
QFN-10_PAD = smd 0.297 x 0.85: 1 -1,-1.475; 2 -0.5,-1.475; 3 0,-1.475; 4 0.5,-1.475; 5 1,-1.475; 6 1,1.475; 7 0.5,1.475; 8 0,1.475; 9 -0.5,1.475; 10 -1,1.475 | smd 0.7 x 0.28: 11 -1.5,0.25; 12 -1.5,-0.25; 13 1.5,0.25; 14 1.5,-0.25 | smd 2.4 x 1.65: 15 0,0
QFN-24/3MM = smd 0.6 x 0.23: 1 -1.5,1; 2 -1.5,0.6; 3 -1.5,0.2; 4 -1.5,-0.2; 5 -1.5,-0.6; 6 -1.5,-1; 13 1.5,-1; 14 1.5,-0.6; 15 1.5,-0.2; 16 1.5,0.2; 17 1.5,0.6; 18 1.5,1 | smd 0.23 x 0.6: 7 -1,-1.5; 8 -0.6,-1.5; 9 -0.2,-1.5; 10 0.2,-1.5; 11 0.6,-1.5; 12 1,-1.5; 19 1,1.5; 20 0.6,1.5; 21 0.2,1.5; 22 -0.2,1.5; 23 -0.6,1.5; 24 -1,1.5
MINI54TAN = smd 0.203 x 1.5: 1 -2.75,-4.5; 2 -2.25,-4.5; 3 -1.75,-4.5; 4 -1.25,-4.5; 5 -0.75,-4.5; 6 -0.25,-4.5; 7 0.25,-4.5; 8 0.75,-4.5; 9 1.25,-4.5; 10 1.75,-4.5; 11 2.25,-4.5; 12 2.75,-4.5; 25 2.75,4.5; 26 2.25,4.5; 27 1.75,4.5; 28 1.25,4.5; 29 0.75,4.5; 30 0.25,4.5; 31 -0.25,4.5; 32 -0.75,4.5; 33 -1.25,4.5; 34 -1.75,4.5; 35 -2.25,4.5; 36 -2.75,4.5 | smd 1.5 x 0.203: 13 4.5,-2.75; 14 4.5,-2.25; 15 4.5,-1.75; 16 4.5,-1.25; 17 4.5,-0.75; 18 4.5,-0.25; 19 4.5,0.25; 20 4.5,0.75; 21 4.5,1.25; 22 4.5,1.75; 23 4.5,2.25; 24 4.5,2.75; 37 -4.5,2.75; 38 -4.5,2.25; 39 -4.5,1.75; 40 -4.5,1.25; 41 -4.5,0.75; 42 -4.5,0.25; 43 -4.5,-0.25; 44 -4.5,-0.75; 45 -4.5,-1.25; 46 -4.5,-1.75; 47 -4.5,-2.25; 48 -4.5,-2.75
ANTENNA-CHIP2 = smd 1.7 x 1: FEED 0,1.25; P$2 0,-1.25
SOP8 = smd 0.6 x 0.4: 1 -2.2,1.8; 2 -2.2,0.6; 3 -2.2,-0.6; 4 -2.2,-1.8; 5 2.2,-1.8; 6 2.2,-0.6; 7 2.2,0.6; 8 2.2,1.8
QFN20(4X4) = smd 0.4 x 0.25: 1 -1.8,1; 2 -1.8,0.5; 3 -1.8,0; 4 -1.8,-0.5; 5 -1.8,-1; 11 1.8,-1; 12 1.8,-0.5; 13 1.8,0; 14 1.8,0.5; 15 1.8,1 | smd 0.25 x 0.4: 6 -1,-1.8; 7 -0.5,-1.8; 8 0,-1.8; 9 0.5,-1.8; 10 1,-1.8; 16 1,1.8; 17 0.5,1.8; 18 0,1.8; 19 -0.5,1.8; 20 -1,1.8
QFN32 = smd 0.4 x 0.25: CHIP_EN/7 -2.3,-1.25; DVDD/24 2.3,1.75; LNA/2 -2.3,1.25; SD_CLK/21 2.3,0.25; SD_CMD/20 2.3,-0.25; SD_DATA_0/22 2.3,0.75; SD_DATA_1/23 2.3,1.25; SD_DATA_2/18 2.3,-1.25; SD_DATA_3/19 2.3,-0.75; TOUT/6 -2.3,-0.75; VDD3P3/3 -2.3,0.75; VDD3P3/4 -2.3,0.25; VDD_RTC/5 -2.3,-0.25; VDDA/1 -2.3,1.75; VDDPST/17 2.3,-1.75; XPD_DCDC/8 -2.3,-1.75 | smd 0.25 x 0.4: EXT_RSTB/32 -1.75,2.3; GPIO0/15 1.25,-2.3; GPIO2/14 0.75,-2.3; MTCK/12 -0.25,-2.3; MTDI/10 -1.25,-2.3; MTDO/13 0.25,-2.3; MTMS/9 -1.75,-2.3; RES12K/31 -1.25,2.3; U0RXD/25 1.75,2.3; U0TXD/26 1.25,2.3; VDD/16 1.75,-2.3; VDDA/30 -0.75,2.3; VDDD/29 -0.25,2.3; VDDPST/11 -0.75,-2.3; XTAL_IN/28 0.25,2.3; XTAL_OUT/27 0.75,2.3 | smd 2.54 x 2.54: GND 0,0
CRYSTAL-TXC-7A = smd 1.7 x 2.4: P$1 1.85,0; P$2 -1.85,0
CRYSTAL-SMD-5X3 = smd 1.9 x 1.1: 1 -1.85,-1.15; 2 1.85,-1.15; 3 1.85,1.15; 4 -1.85,1.15

### Placement (x,y rotation side)
C1  40.13,9.91 0 top
C2  43.76,6.38 0 top
C3  40.26,16.18 0 top
C4  35.99,13.77 180 top
C5  25.32,32.28 315 top
C6  26.67,42.04 0 top
C7  34.82,47.78 0 top
C8  3.53,41.35 0 top
C9  8.84,48.23 180 top
C10  8.84,50.29 180 top
C11  8.13,21.84 180 top
C12  3.91,53.42 180 top
C13  3.89,50.52 0 top
C14  12.42,42.8 270 top
C15  11.15,47.29 90 top
C16  7.87,27.43 180 top
C17  6.6,24.38 270 top
C18  26.29,15.37 0 top
C19  9.91,28.7 180 top
C20  10.67,30.99 90 top
C21  40.26,18.03 0 top
C22  36.93,28.6 180 top
C23  27.71,46.84 180 top
C24  36.93,30.63 180 top
C25  3.53,43.64 180 top
C26  24.77,2.29 180 top
C27  32.11,27.81 90 top
C28  22.99,15.37 180 top
C29  22.1,20.57 0 top
C30  28.96,22.1 180 top
C31  14.35,16.64 0 top
C32  17.65,16.64 180 top
J1  8.61,3.81 0 top
JP2  45.36,39.62 270 top
JP3  48.13,39.62 270 top
JP4  50.9,39.62 270 top
JP5  52.32,10.54 0 top
L1  36.55,10.74 270 top
L2  8.86,51.77 0 top
L3  7.11,31.88 90 top
L4  3.94,24.38 90 top
L5  5.05,47.96 90 top
L6  2.72,47.98 90 top
L7  15.75,4.57 270 top
LED1  45.92,18.67 180 top
LED2  51.18,46.48 270 top
LED3  51.18,48.77 270 top
LED4  51.18,51.05 270 top
PROGRAM  34.04,4.57 225 top
R1  26.7,44.15 180 top
R2  46.3,9.3 90 top
R3  44.15,9.17 270 top
R4  45.03,11.96 180 top
R5  29.03,38.46 0 top
R6  43.43,16.05 180 top
R7  43.43,18.14 180 top
R8  48.01,46.48 0 top
R9  47.73,16.97 270 top
R10  40.18,7.7 180 top
R11  17.75,47.52 90 top
R12  3.53,45.69 180 top
R13  31.17,34.77 180 top
R14  34.54,34.82 0 top
R15  48.01,48.77 0 top
R16  9.65,24.38 270 top
R17  48.01,51.05 0 top
RN1  8.43,11.68 0 top
S1  52.45,5.84 180 top
U1  18.29,27.94 0 top
U2  41.15,12.7 270 top
U3  32.54,31.72 0 top
U4  25.65,8.89 270 top
U$1  23.34,38.38 0 top
U$2  8.86,53.77 90 top
U$3  37.62,42.09 90 top
U$4  8.86,43.66 90 top
U$6  31.29,42.16 0 top
Y1  16.13,14.1 0 top
Y2  26.67,19.43 180 top
Y3  30.4,49.43 180 top
Y4  14.96,46.2 90 top

### Tracks (layer width: path | path; a pad name or v marks a point on that pad's centre or on a via)
3.3V  (via drill 0.6, 0.61)  (1 unrouted)
  Top 0.254: U1.3 12.54,30.73 | C25.1 4.41,43.66 U$4.18 7.49,43.66 7.99,43.16 | 7.99,43.16 U$4.7 | U$6.VDDA/1 29.21,43.91 29.44,43.69 | 29.44,43.69 29.44,42.86 U$6.VDD3P3/4 | U$6.VDD3P3/4 U$6.VDD3P3/3 | 29.44,43.69 29.69,43.94 30.96,43.94 31.04,44.02 U$6.VDDD/29 | U$6.VDD3P3/4 29.21,42.41 29.57,42.06 29.57,40.95 29.87,40.64 30.3,40.64 30.56,40.39 | 30.56,40.39 30.56,39.88 U$6.VDDPST/11 | 30.56,40.39 33.56,40.39 U$6.VDDPST/17 33.88,40.41 34.04,40.26 34.04,37.85 34.14,37.74 | U1.21 arc45 16.56,22.3 16.56,23.32 16.51,23.37 | U1.8 arc45 12.6,28.21 12.6,28.66 | 12.54,30.73 arc45 12.67,30.68 | 23.95,31.67 arc45 U1.48 24.51,31.69 24.7,31.69 24.89,31.88 24.89,32.72 C5.1 | 12.6,28.66 arc45 U1.7 | 31.94,30.72 U3.8 31.94,29.75 | 31.94,30.72 32.18,30.96 33.12,30.96 | 33.12,30.96 33.36,30.73 U3.13 34.53,30.73 34.62,30.63 | U1.30 21.04,23.16 | 12.6,28.66 10.79,28.66 C19.1 10.76,30.05 C20.1 | 12.54,30.73 11.26,30.73 C20.1 | C20.1 7.98,32.83 L3.2 6.81,33.13 6.81,41.63 7.99,42.82 7.99,43.16 | R13.1 32.34,34.45 U3.22 32.33,32.94 33.12,32.16 33.12,30.96 | U3.1 31.04,31.62 31.94,30.72 | 25.4,13.46 25.47,13.39 U4.42 U4.43 25.4,15.33 C18.1 C28.1 | C28.1 25.27,15.37 25.4,15.24 23.96,15.24 C28.1 | U2.2 38.68,13.21 38.08,13.82 | 38.1,17.53 38.61,18.03 C21.1 39.28,17.91 | U$3.8 35.82,43.41 v36.3,42.93
  Top 0.406: 12.67,30.68 14.94,30.68 15.24,30.99 16.13,30.99 16.51,30.61 16.51,28.83 | 16.51,23.37 16.51,26.92 | 16.51,26.92 20.19,26.92 20.43,26.68 21.04,26.08 21.04,23.16 | 24.51,31.69 24.5,31.67 22.3,31.67 21.72,32.26 20.45,32.26 17.02,28.83 16.51,28.83 | 16.51,28.83 16.51,26.92 | C24.2 34.62,30.63
  Top 0.61: R13.1 32.07,34.82 R14.1 34.99,36.12 35.76,36.12 | 39.28,17.91 39.28,16.31 C3.1 | 38.08,13.82 38.08,17.5 38.1,17.53 38.63,18.06 39.42,18.06 | 34.14,37.74 35.76,36.12 | 35.76,36.12 39.17,36.12
  Top 1.016: v49.78,19.3 48.51,19.3 48.26,19.56 45.94,19.56 LED1.A 43.17,19.55 42.58,18.96 R7.2 39.5,18.14 39.42,18.06 39.42,19.43 v34.98,23.88 36.08,24.98 C22.2 C24.2 | v39.17,37.54 39.17,36.12 39.17,34.92 36.08,31.84 | v22.12,24.36 21.97,24.36 21.57,24.77 21.57,25.55 20.43,26.68
  Bottom 0.254: v36.3,42.93 36.3,42.49 35.71,41.91 35.71,39.98 38.15,37.54 v39.17,37.54
  Bottom 1.016: JP4.1 JP4.2 JP4.3 JP4.4 JP4.5 JP4.6 JP4.7 JP4.8 50.9,19.91 50.29,19.3 v49.78,19.3 | v34.98,23.88 30.18,28.68 27.79,28.68 23.47,24.36 v22.12,24.36
  other vias: 50.9,21.84
FB
  Top 0.254: 42.58,16.17 R6.2 43.18,15.46 43.18,13.82 43.06,13.7 U2.10 | 44.32,17.91 R7.1
  Top 0.61: 42.58,16.17 44.28,17.87 R7.1
GND  (via drill 0.6, 0.61)  (1 unrouted)
  Top 0.178: 33.45,32.72 33.14,33.03
  Top 0.254: 5.22,42.66 4.83,42.27 2.54,42.27 2.54,43.5 C25.2 | U$6.GND 31.29,42.09 v32.77,43.56 | 33.45,32.72 33.46,32.73 U3.18 34.95,32.72 35.46,33.22 v35.48,33.22 | 33.14,33.03 U3.20 | U1.47 25.43,31.19 C5.2 25.15,30.9 25.15,30.73 25.27,30.61 v25.27,30.23 | C15.2 12.56,48.15 v12.45,48.13 | C26.2 24.9,3.27 U4.17 24.89,4.4 v24.89,6.48 | R1.2 25.78,44.59 25.78,45.76 | C23.2 26.54,46.52 | U1.4 14.01,30.19 14.61,29.59 15.37,29.59 v15.62,29.97 | 20.87,20.49 C29.1 | U1.31 21.54,20.99 C29.1 | C29.1 20.83,20.36 20.61,20.57 19.94,20.57 | 10.5,32 9.91,32 9.53,32.38 v9.53,33.11 | 3.58,44.55 5.84,44.55 6.23,44.16 U$4.17 8.77,44.16 9.27,43.66 U$4.8 10.95,43.66 12.42,42.19 C14.2 | 3.05,45.33 R12.2 | U$4.20 6.98,42.66 5.84,41.53 5.84,39.88 | U4.5 22.59,9.64 23.3,10.35 | 23.3,10.35 23.4,10.45 U4.47 23.4,14.1 C28.2 | v24.89,9.4 23.43,10.35 23.3,10.35 | J1.5 9.91,8.76 10.16,9.02 12.95,9.02 15.75,6.22 L7.1 | C32.1 18.54,16.68 18.54,17.53 17.78,18.29 v17.14,18.29 | v14.48,18.29 13.84,17.65 13.59,18.03 | v37.59,46.1 37.34,45.85 37.21,45.85 | R5.1 28.19,38.44 28.19,37.72 28.57,37.34 v28.57,36.96 | C30.1 29.81,23.03 v29.21,23.62 | C18.2 27.27,15.49 v28.83,15.49 | C1.2 40.9,9.99 U2.14 40.9,12.45 U2.15 | C3.2 40.9,15.54 U2.12 41.15,13.95 U2.15 | R4.1 45.88,13.12 v45.97,13.21 | v45.97,15.75 44.41,15.75 | 44.41,15.75 R6.1 | U2.4 40.65,12.2 U2.15 | U2.15 41.4,12.95 41.4,13.21 41.41,13.2 U2.9 43.07,13.2 43.79,13.92 43.79,14.25 44.32,14.78 44.32,14.91 44.41,15 44.41,15.75 | v39.04,32.23 39.42,31.85 39.42,30.63 C24.1
  Bottom 0.254: v7.37,28.96 7.11,33.02 | v12.45,48.13 7.72,48.13 v6.68,49.17 | v15.62,29.97 15.75,30.61 14.52,31.84 C20.2 10.41,32.09 10.41,33.27 10.16,33.53 9.91,33.53 9.53,33.15 v9.53,33.11 | v24.89,6.48 v24.89,9.4 | v17.14,18.29 16.89,18.54 16.71,18.52 | 16.71,18.52 v14.48,18.29 | v29.21,26.67 v29.21,23.62 | v37.59,46.1 37.59,47.37 37.08,47.88 33.66,47.88 32.77,46.99 v32.77,43.56 32.07,42.86 32.07,40.45 v28.57,36.96 | 16.71,18.52 16.71,19.49 16.51,19.68 16.51,21.46 16.89,21.84 19.43,21.84 19.94,21.34 19.94,20.19 v20.95,19.05 23.37,16.64 28.7,16.64 29.08,16.26 29.08,15.75 v28.83,15.49 | v45.97,13.21 v45.97,15.75 | v35.48,33.22 36.47,32.23 v39.04,32.23
  pour Top: -22.35,85.6 68.07,85.6 68.07,-17.78 -22.35,-17.78
  pour Bottom: -10.16,73.15 73.15,72.64 73.15,-10.92 -10.16,-10.41
ID  (via drill 0.61)  (1 unrouted)
  Top 0.254: J1.4 9.26,8.88 10.03,9.65 | U1.23 17.54,20.43 21.59,16.38 29.34,16.38 29.84,15.88 29.84,15.11 29.34,14.61 28.32,14.61 27.9,14.19 U4.38 27.9,10.89 v27.56,10.54
  Bottom 0.254: v23.24,6.48 23.24,9.27 24.51,10.54 v27.56,10.54
N$1
  Top 0.61: LED1.C 47.7,17.79 R9.1
N$2
  Top 0.254: U2.3 38.86,12.7 38.61,12.45 | 37.59,12.19 37.34,11.94 36.63,11.94 L1.1
  Top 0.406: 37.59,12.19 38.35,12.19 38.61,12.45
N$4
  Top 0.254: 35.69,47.5 35.69,49.15 33.27,51.56 27.05,51.56 26.8,51.31 26.8,47.12
N$5
  Top 0.254: 29.08,42.8 29.08,42.67
N$7
  Top 0.254: R8.2 LED2.A
N$8
  Top 0.254: R15.2 LED3.A
N$9
  Top 0.254: R17.2 LED4.A
N$10
  Top 0.254: U4.20 26.4,3.31 27.37,2.35 PROGRAM.P$2
N$11
  Top 0.254: U4.18 25.4,2.5 C26.1 25.87,2.58
N$13
  Top 0.254: U$6.LNA/2 28.89,43.31 C6.2
N$14
  Top 0.254: 11.3,48.64 11.3,48.9 12.32,49.91 18.16,49.91 18.92,49.15 18.92,45.09 15.88,42.04 12.45,42.04
N$15
  Top 0.254: 13.08,16.51 12.83,16.26 12.83,12.83 13.46,12.19 19.05,12.19 19.43,12.57 19.43,15.75 18.8,16.38 18.8,16.64
N$16
  Top 0.254: C6.1 25.95,41.98 25.18,41.98 23.34,40.14 U$1.FEED 23.85,39.88
N$17
  Top 0.254: U$4.9 11.53,44.16 12.04,43.65 C14.1 13.27,42.8 15.37,42.8 16.11,43.54 Y4.1 17.75,46 R11.1 17.65,46.57
N$18
  Top 0.254: U$4.10 11.13,44.66 11.3,44.83 11.3,46.34 C15.1 12.2,46.45 Y4.3 13.56,48.61 14.35,49.4 16.73,49.4 R11.2
N$19
  Top 0.254: U$4.11 9.87,48.06 C9.1 C10.1 9.52,50.47 L2.2
N$20
  Top 0.254: U$4.13 8.89,45.49 8.89,46.08 8.38,46.58 5.78,46.58 L5.1 2.74,47.3 L6.1
N$21
  Top 0.254: C8.2 4.67,41.35 6.49,43.16 U$4.19
N$22
  Top 0.406: 38.05,13.84 38.05,13.82 38.68,13.18 39.4,13.18
N$23
  Top 0.254: U$4.12 9.37,46.62 8.61,47.37 6.29,47.37 L5.2 5.33,48.63 5.33,49.38 7.72,51.77 L2.1
N$24
  Top 0.254: U$4.16 6.06,45.67 R12.1
N$25
  Top 0.254: C13.1 2.79,50.28 arc45 2.72,50.1 L6.2
N$26
  Top 0.254: C13.2 4.76,50.55 C12.1 7.26,53.42 U$2.FEED
N$27
  Top 0.254: U1.32 22.04,20.85 C29.2 22.78,20.32 Y2.3
N$28
  Top 0.254: Y2.1 28.52,22.19 C30.2 26.67,22.1 24.58,24.19 U1.33
N$29
  Top 0.254: U1.19 15.54,16.97 C31.2 15.2,15.02 Y1.P$2
N$30
  Top 0.254: U1.20 16.04,17.4 C32.2 16.8,15.27 Y1.P$1
N$31
  Top 0.254: 29.97,22.48 30.23,22.23 30.23,17.91 29.59,17.27 23.5,17.27 22.35,18.41 22.35,18.92 21.08,20.19 21.08,20.57
N$32
  Top 0.254: R5.2 31.04,39.62 U$6.MTCK/12
N$34
  Top 0.254: U3.10 32.74,29.3 C27.2
N$38
  Top 0.254: R1.1 27.55,45.33 28.19,45.97 29.46,45.97 30.04,45.4 U$6.RES12K/31
PS
  Top 0.254: U2.8 43.18,12.7 44.7,14.22
  Top 0.61: 44.7,14.22 44.88,14.4 46.84,14.4 47.5,13.74 47.5,11.34 R2.2
PTA2
  Top 0.254: U1.24 18.04,20.7 21.84,16.89 29.59,16.89 30.35,16.13 30.35,14.86 29.64,14.15 28.47,14.15 28.4,14.08 U4.37
PTB0
  Top 0.254: U3.12 33.54,26.04 32.68,25.19 U1.35
PTB1
  Top 0.254: U1.36 24.02,25.65 32.51,25.65 33.14,26.28 U3.11
PTB2  (via drill 0.61)
  Top 0.254: R8.1 v45.34,46.48 | v20.83,28.32 20.83,27.94 22.58,26.19 U1.37
  Bottom 0.254: v45.34,46.48 40.01,42.93 40.01,45.72 33.66,52.07 26.8,52.07 25.65,50.93 25.65,33.91 21.84,30.1 21.46,30.1 20.83,29.46 v20.83,28.32
PTB16  (via drill 0.6)
  Top 0.254: U1.39 24,27.18 28.44,27.18 30.23,28.96 30.23,32.41 v29.29,33.35 | v34.42,45.77 33.76,45.77 33.04,45.06 U$6.U0RXD/25
  Bottom 0.254: v34.42,45.77 34.8,45.39 34.8,44.7 32.89,42.8 32.89,36.32 32.64,36.07 30.48,36.07 29.29,34.87 v29.29,33.35
PTB17  (via drill 0.61)
  Top 0.254: U$6.U0TXD/26 32.54,45.5 33.78,46.74 35.05,46.74 v35.69,46.1 | U1.40 28.2,27.69 29.34,28.83 v29.34,31.88
  Bottom 0.254: v35.69,46.1 35.69,44.83 33.4,42.55 33.4,36.07 32.89,35.56 30.73,35.56 30.1,34.92 30.1,32.77 v29.34,31.88
PTB18
  Top 0.254: U$6.GPIO0/15 32.54,38.77 arc-45 32.45,38.55 28.45,34.54 28.45,30.48 26.16,28.19 U1.41
PTB19
  Top 0.254: U$6.GPIO2/14 32.04,39.03 arc-45 31.95,38.81 27.94,34.8 27.94,30.87 arc-45 27.85,30.64 25.99,28.78 arc-45 25.76,28.69 U1.42
PTC0  (via drill 0.61)
  Top 0.254: U1.43 arc-45 24.04,29.21 25.65,29.21 27.34,30.89 arc45 27.43,31.12 27.43,36.58 26.8,37.21 v26.8,38.61 | v28.7,45.21 29.08,45.21 arc-45 29.3,45.12 29.46,44.96 arc-45 29.54,44.77 U$6.EXT_RSTB/32
  Bottom 0.254: v28.7,45.21 28.07,45.21 26.8,43.94 v26.8,38.61
PTC1  (via drill 0.61)
  Top 0.254: v21.84,29.34 21.84,28.96 22.1,28.7 22.61,28.7 22.86,28.96 22.86,29.34 23.21,29.69 U1.44 | v26.54,34.04 26.54,36.83 25.91,37.47 25.91,39.12 27.71,40.91 U$6.CHIP_EN/7
  Bottom 0.254: v26.54,34.04 v21.84,29.34
PTC2  (via drill 0.61)
  Top 0.254: U1.45 21.3,30.19 19.94,28.83 19.56,28.83 v19.43,28.96 | v45.21,48.77 R15.1
  Bottom 0.254: v19.43,28.96 19.43,29.46 20.45,30.48 21.46,30.48 25.15,34.16 25.15,51.18 26.54,52.58 33.78,52.58 40.51,45.85 40.51,44.58 v45.21,48.77
PTC3  (via drill 0.61)
  Top 0.254: R17.1 v45.21,51.05 | U1.46 21.76,30.69 v21.08,31.37
  Bottom 0.254: v45.21,51.05 44.83,51.05 33.91,53.09 26.42,53.09 24.64,51.31 24.64,34.42 22.35,32.13 21.46,32.13 21.08,31.75 v21.08,31.37
PTC4  (via drill 0.6)
  Top 0.254: U1.49 22.1,33.7 22.1,34.29 22.38,34.57 v22.94,34.57 | U$4.2 8.37,38.62 12.06,34.92 v12.83,34.92
  Bottom 0.254: v22.94,34.57 23.11,34.39 23.11,34.04 22.35,33.27 14.48,33.27 v12.83,34.92
PTC5  (via drill 0.6)
  Top 0.254: U1.50 21.54,37.14 v20.95,37.72 | U$4.3 8.87,38.89 11.3,36.45 13.59,36.45 14.33,37.19 v14.35,37.19
  Bottom 0.254: 20.85,37.82 v20.95,37.72 20.83,37.85 20.32,37.85 19.66,37.19 v14.35,37.19
PTC6  (via drill 0.6)
  Top 0.254: 21.08,33.68 U1.51 21.04,35.68 v20.34,36.37 | v10.08,39.06 9.65,39.55 9.37,39.84 U$4.4
  Bottom 0.254: v10.08,39.06 10.29,38.86 11.3,38.86 11.81,38.35 11.81,37.85 13.28,36.37 v20.34,36.37
PTC7  (via drill 0.6)
  Top 0.254: U1.52 20.54,34.48 v19.96,35.05 | v10.9,38.05 10.9,39.52 9.87,40.55 U$4.5
  Bottom 0.254: v19.96,35.05 19.2,35.81 13.13,35.81 v10.9,38.05
PTC8  (via drill 0.6)
  Top 0.254: U1.53 20.04,32.74 19.43,32.13 13.97,32.13 12.95,33.15 v11.3,33.15 | U$4.6 11.19,42.66 11.3,42.55 11.3,41.17 v11.07,40.95
  Bottom 0.254: v11.07,40.95 10.46,40.95 9.14,39.62 9.14,35.31 v11.3,33.15
PTC9
  Top 0.254: U1.54 19.56,33.62 19.56,33.02 19.05,32.51 14.22,32.51 12.95,33.78 12.19,33.78 7.87,38.11 U$4.1
PTC10
  Top 0.254: 19.05,33.65 U1.55 19.04,38.09 23.37,42.42 23.37,49.78 26.04,52.45 34.8,52.45 40.64,46.61 40.64,26.57 JP2.8
PTC11
  Top 0.254: JP2.7 41.15,28.6 41.15,46.86 35.05,52.96 25.78,52.96 22.86,50.04 22.86,42.67 18.54,38.35 U1.56
PTD0
  Top 0.254: U1.57 18.04,38.61 22.35,42.93 22.35,50.29 25.53,53.47 35.31,53.47 41.66,47.12 41.66,30.63 JP2.6
PTD1
  Top 0.254: U1.58 17.55,33.65 | U1.58 17.53,33.65 | JP2.5 42.16,32.66 42.16,47.37 35.56,53.98 25.27,53.98 21.84,50.55 21.84,43.18 17.54,38.87 U1.58
PTD2
  Top 0.254: 17.02,33.66 U1.59 17.04,39.14 21.34,43.43 21.34,50.8 25.02,54.48 35.81,54.48 42.67,47.62 42.67,34.7 JP2.4
PTD3
  Top 0.254: 16.51,33.67 U1.60 16.54,39.4 20.83,43.69 20.83,51.05 24.77,54.99 36.07,54.99 43.18,47.88 43.18,36.73 JP2.3
PTD4
  Top 0.254: U1.61 16,33.68 16,39.62 20.32,43.94 20.32,51.31 24.51,55.5 36.32,55.5 43.69,48.13 43.69,38.76 JP2.2
PTD5
  Top 0.254: U1.62 15.49,33.68 15.49,39.88 19.81,44.2 19.81,51.56 24.26,56.01 36.7,56.01 44.2,48.51 44.2,40.79 JP2.1
RESET_B  (via drill 0.61)
  Top 0.254: U1.34 24.04,24.64 31.75,24.64 33.15,23.24 v33.15,17.14 | U4.8 24.9,8.14 24.92,8.13 v26.54,8.13
  Bottom 0.254: v26.54,8.13 32.26,8.13 33.53,9.4 33.53,15.75 33.15,16.13 v33.15,17.14
SCL  (via drill 0.61)
  Top 0.254: v36.98,34.77 35.36,34.79 R14.2 | U3.23 31.94,32.22 v32.13,32.03
  Bottom 0.254: v32.13,32.03 32.59,32.03 36.17,35.61 37.13,35.61 37.44,35.31 37.44,35.08 37.13,34.77 v36.98,34.77
SD-CLK  (via drill 0.6)
  Top 0.178: U$6.SD_CLK/21 34.57,42.41 35.99,41 v36.6,41 | v38.84,43.13 38.84,43.67 U$3.6
  Bottom 0.178: v36.6,41 36.7,41 v38.84,43.13
SD-CMD
  Top 0.178: 33.61,41.94 34.42,41.94 35.82,40.53 U$3.1
  Top 0.254: U$6.SD_CMD/20 33.61,41.94 | 35.82,40.08 U$3.1
SD-D0
  Top 0.178: U$6.SD_DATA_0/22 35.12,42.91 36.12,41.91 37.16,41.91 37.59,41.48 37.59,40.41 37.07,39.89 U$3.2
  Top 0.254: 37.01,39.9 U$3.2
SD-D1
  Top 0.178: U$3.5 arc45 39.37,44.4 38.63,45.14 35.9,45.14 arc45 35.67,45.04 34.13,43.51 arc-45 33.91,43.41 U$6.SD_DATA_1/23
  Top 0.254: U$6.SD_DATA_1/23 33.91,43.41
SD-D2
  Top 0.178: 37.03,44.27 37.03,43.28 38.84,41.48 38.84,39.34 38.02,38.53 35.41,38.53 34.54,39.4 34.54,40.46 34.11,40.89 33.61,40.89 U$6.SD_DATA_2/18
  Top 0.254: 37.03,44.27 U$3.7
SD-D3
  Top 0.178: 34.08,41.41 34.28,41.41 34.98,40.72 34.98,39.65 35.53,39.09 37.42,39.09 U$3.3
  Top 0.254: U$6.SD_DATA_3/19 34.08,41.41
SDA
  Top 0.254: U3.24 31.54,33.55 R13.2
SOFTPOWER
  Top 0.254: R10.1 41.48,7.7 | U2.6 43.01,11.7 43.26,11.46
  Top 0.406: 43.26,11.46 43.26,10.54 42.27,9.55 42.27,8.93 R10.1
SWD_CLK  (via drill 0.61)
  Top 0.254: U1.22 17.04,20.3 21.08,16.26 v21.08,14.1 | U4.32 32,9.64 32.51,10.15 v32.51,12.19
  Bottom 0.254: v21.08,14.1 21.46,13.72 31.5,13.72 32.51,12.7 v32.51,12.19
SWD_DIO  (via drill 0.61)
  Top 0.254: U4.33 U4.34 31.34,10.64 v31.62,10.92 | v19.05,20.95 18.54,21.47 U1.25
  Bottom 0.254: v19.05,20.95 19.05,19.56 19.94,18.67 19.94,13.59 20.7,12.83 30.48,12.83 31.62,11.68 v31.62,10.92
USB_CON_N
  Top 0.254: J1.2 8.09,9.05 RN1.1
USB_CON_P
  Top 0.254: J1.3 8.74,9.01 RN1.2
USB_D_N  (1 unrouted)
  Top 0.254: U1.6 13.16,29.19 13.99,28.35 13.99,23.97 12.22,22.19
USB_D_P  (1 unrouted)
  Top 0.254: U1.5 13.3,29.69 14.45,28.54 14.45,23.78 12.68,22
USB_SHIELD
  Top 0.254: 12.02,4.89 11.94,4.79 10.95,3.81 6.73,3.81 5.75,4.79 5.54,4.79 J1.S1 5.41,5.81 J1.S3 | 12.02,4.89 J1.S2 14,3.62 L7.2 | J1.S4 11.81,5.1 12.02,4.89
UVLO
  Top 0.254: 44.2,11.95 R4.2 | 44.15,11.92 R4.2 | R4.2 43.95,12.2 U2.7
  Top 0.406: C2.2 44.61,6.79 44.17,7.24 43.56,7.24 43.05,7.75 43.05,8.93 R3.1
  Top 0.61: 44.15,11.92 R3.1
VAUX  (via drill 0.61)
  Top 0.406: U2.1 39.21,13.7 38.86,14.05 38.86,14.2 v39.57,14.91
  Top 0.61: C4.1 36.78,13.83 36.78,15.7 v37.08,16
  Bottom 0.61: v37.08,16 39.09,16 39.57,15.52 v39.57,14.91
VCC  (2 unrouted)
  Top 0.254: 39.67,10.3 C1.1 | 46.18,8.32 R2.1
  Top 0.406: C2.1 42.91,5.96 43.61,5.26 45.11,5.26 46.3,6.45 R2.1 | U2.5 39.21,11.7 38.81,11.3
  Top 0.61: 46.18,8.32 R3.2 | C2.1 39.98,6.38 39.5,6.86 39.5,7.53 R10.2 39.33,9.86 C1.1 | L1.2 38.18,9.47 38.58,9.88 39.26,9.88 C1.1 | C1.1 39.12,9.91 38.81,10.21 38.81,11.3
VDDA
  Top 0.254: U1.13 12.55,25.65 10.07,25.65 R16.1 C17.1 5.59,26.16 5.59,29.46 7.05,30.93 L3.1
VRAW  (1 unrouted)
VREF_OUT  (via drill 0.61)
  Top 0.254: U1.17 14.54,21.9 13.97,21.34 v13.97,20.83 | C16.1 9.23,26.92 v10.41,26.92
  Bottom 0.254: v13.97,20.83 14.48,20.32 14.73,20.32 14.99,20.57 14.99,23.11 16,24.13 16,28.19 13.72,30.48 12.19,30.48 11.43,29.72 11.43,27.94 v10.41,26.92
VREFH
  Top 0.254: U1.14 11.31,25.19 R16.2 9.65,22.52 C11.1
VREFL  (via drill 0.61)
  Top 0.254: U1.15 U1.16 12.06,24.19 10.79,22.92 10.79,21.59 9.91,20.7 8,20.7 7.28,21.42 C11.2 | C11.2 7.11,22.01 7.11,22.1 7.62,21.59 | C17.2 7.79,23.53 v8.13,23.88 | 7.62,21.76 C11.2 | 6.45,23.69 C17.2 | C16.2 8.13,26.33 v8.13,26.16 | C17.2 4.8,25.33 L4.2 | C17.2 6.6,22.52 C11.2
  Bottom 0.254: v8.13,23.88 v8.13,26.16
XTAL_IN
  Top 0.254: Y3.3 C23.1 28.66,46.74 29.72,46.74 31.54,44.91 U$6.XTAL_IN/28
XTAL_OUT
  Top 0.254: U$6.XTAL_OUT/27 32.04,45.89 33.93,47.78 C7.1 | C7.1 33.97,48.22 | Y3.1 32.86,50.58 33.97,49.47 C7.1